# EAGLE design INTRO Robot Shield (EAGLE 6.4)
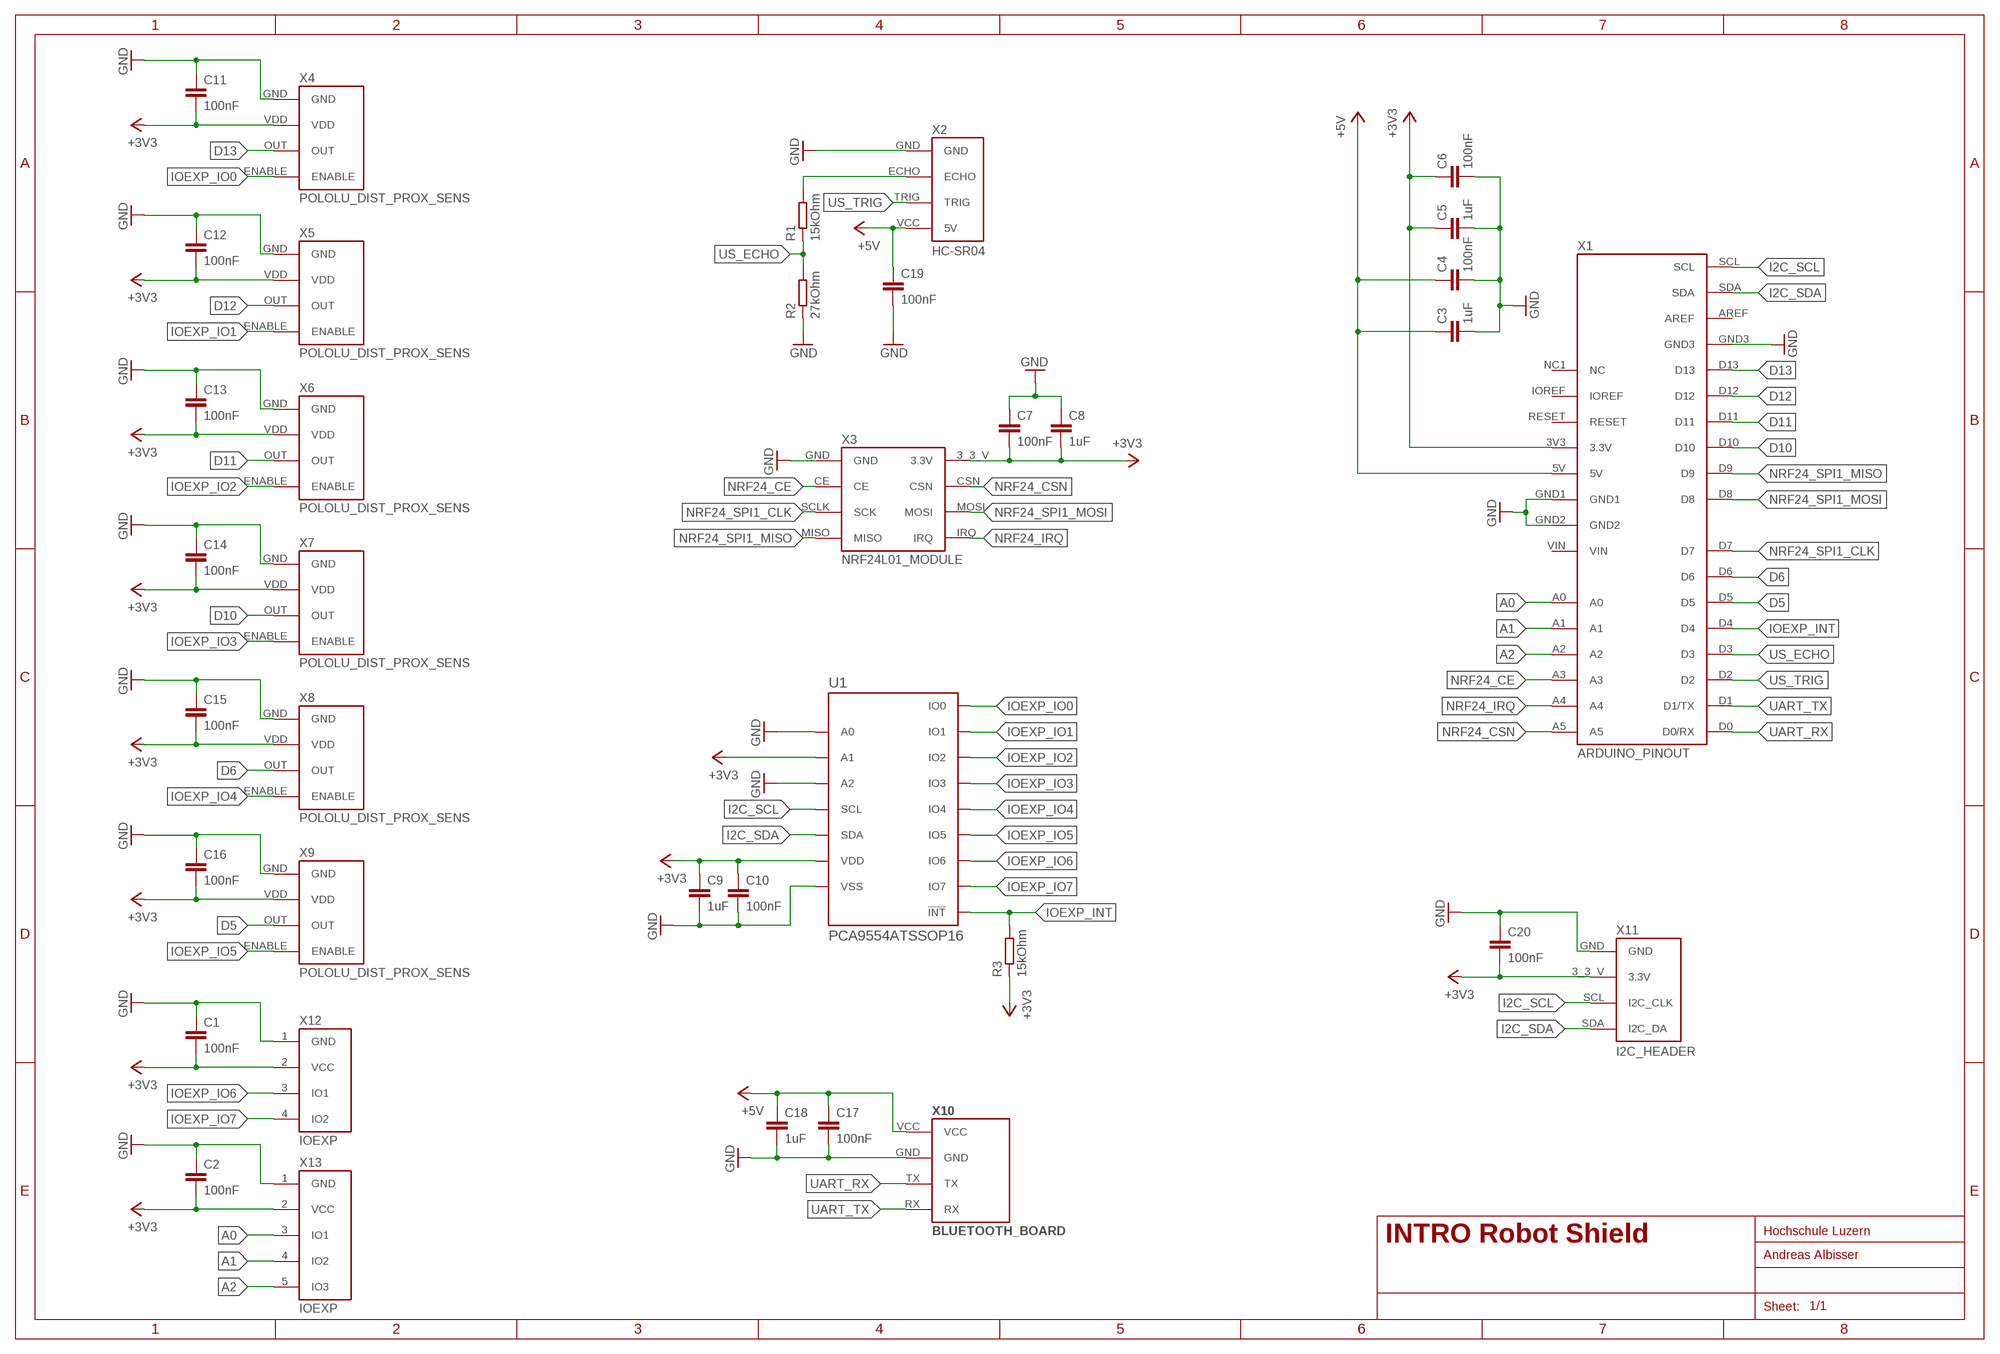
[diagram p0: schematic, sheet 1]

## Parts
C1  100nF  CAPACITOR0805  [0805]
C2  100nF  CAPACITOR0805  [0805]
C3  1uF  CAPACITOR0805  [0805]
C4  100nF  CAPACITOR0805  [0805]
C5  1uF  CAPACITOR0805  [0805]
C6  100nF  CAPACITOR0805  [0805]
C7  100nF  CAPACITOR0805  [0805]
C8  1uF  CAPACITOR0805  [0805]
C9  1uF  CAPACITOR0805  [0805]
C10  100nF  CAPACITOR0805  [0805]
C11  100nF  CAPACITOR0805  [0805]
C12  100nF  CAPACITOR0805  [0805]
C13  100nF  CAPACITOR0805  [0805]
C14  100nF  CAPACITOR0805  [0805]
C15  100nF  CAPACITOR0805  [0805]
C16  100nF  CAPACITOR0805  [0805]
C17  100nF  CAPACITOR0805  [0805]
C18  1uF  CAPACITOR0805  [0805]
C19  100nF  CAPACITOR0805  [0805]
C20  100nF  CAPACITOR0805  [0805]
R1  15kOhm  RESISTOR0805  [0805]
R2  27kOhm  RESISTOR0805  [0805]
R3  15kOhm  RESISTOR0805  [0805]
U1  PCA9554ATSSOP16  [TSSOP16]
X1  ARDUINO_PINOUT  ARDUINO_PINOUTINNER_LABEL  [ARDUINO_PINOUT_INNER_LABEL]
X2  HC-SR04  [HC-SR04_FOOTPRINT]
X3  NRF24L01_MODULE  [NRF24L01_MODULE_FOOTPRINT]
X4  POLOLU_DIST_PROX_SENS  [POLOLU_DIST_PROX_SENS_FOOTPRINT]
X5  POLOLU_DIST_PROX_SENS  [POLOLU_DIST_PROX_SENS_FOOTPRINT]
X6  POLOLU_DIST_PROX_SENS  [POLOLU_DIST_PROX_SENS_FOOTPRINT]
X7  POLOLU_DIST_PROX_SENS  [POLOLU_DIST_PROX_SENS_FOOTPRINT]
X8  POLOLU_DIST_PROX_SENS  [POLOLU_DIST_PROX_SENS_FOOTPRINT]
X9  POLOLU_DIST_PROX_SENS  [POLOLU_DIST_PROX_SENS_FOOTPRINT]
X10  BLUETOOTH_BOARD  [BT_BOARD_FOOTPRINT]
X11  I2C_HEADER  [I2C_HEADER_FOOTPRINT]
X12  IOEXP  IOEXP_2PTHT_2.54MM  [CONNECTORS_STIFTLEISTE_1X4_2.54]
X13  IOEXP  IOEXP_3PTHT_2.54MM  [CONNECTORS_STIFTLEISTE_1X5_2.54]

## Nets
+3V3: C1.2 C2.2 C5.1 C6.1 C7.2 C8.2 C9.1 C10.1 C11.2 C12.2 C13.2 C14.2 C15.2 C16.2 C20.2 R3.1 U1.2(A1) U1.16(VDD) X1.3V3(3.3V) X3.3_3_V(3.3V) X4.VDD X5.VDD X6.VDD X7.VDD X8.VDD X9.VDD X11.3_3_V(3.3V) X12.2(VCC) X13.2(VCC)
+5V: C3.1 C4.1 C17.1 C18.1 C19.1 X1.5V X2.VCC(5V) X10.VCC
A0: X1.A0 X13.3(IO1)
A1: X1.A1 X13.4(IO2)
A2: X1.A2 X13.5(IO3)
D5: X1.D5 X9.OUT
D6: X1.D6 X8.OUT
D10: X1.D10 X7.OUT
D11: X1.D11 X6.OUT
D12: X1.D12 X5.OUT
D13: X1.D13 X4.OUT
GND: C1.1 C2.1 C3.2 C4.2 C5.2 C6.2 C7.1 C8.1 C9.2 C10.2 C11.1 C12.1 C13.1 C14.1 C15.1 C16.1 C17.2 C18.2 C19.2 C20.1 R2.1 U1.1(A0) U1.3(A2) U1.8(VSS) X1.GND1 X1.GND2 X1.GND3 X2.GND X3.GND X4.GND X5.GND X6.GND X7.GND X8.GND X9.GND X10.GND X11.GND X12.1(GND) X13.1(GND)
I2C_SCL: U1.14(SCL) X1.SCL X11.SCL(I2C_CLK)
I2C_SDA: U1.15(SDA) X1.SDA X11.SDA(I2C_DA)
IOEXP_INT: R3.2 U1.13(!INT) X1.D4
IOEXP_IO0: U1.4(IO0) X4.ENABLE
IOEXP_IO1: U1.5(IO1) X5.ENABLE
IOEXP_IO2: U1.6(IO2) X6.ENABLE
IOEXP_IO3: U1.7(IO3) X7.ENABLE
IOEXP_IO4: U1.9(IO4) X8.ENABLE
IOEXP_IO5: U1.10(IO5) X9.ENABLE
IOEXP_IO6: U1.11(IO6) X12.3(IO1)
IOEXP_IO7: U1.12(IO7) X12.4(IO2)
N$1: R1.2 X2.ECHO
NRF24_CE: X1.A3 X3.CE
NRF24_CSN: X1.A5 X3.CSN
NRF24_IRQ: X1.A4 X3.IRQ
NRF24_SPI1_CLK: X1.D7 X3.SCLK(SCK)
NRF24_SPI1_MISO: X1.D9 X3.MISO
NRF24_SPI1_MOSI: X1.D8 X3.MOSI
UART_RX: X1.D0(D0/RX) X10.TX
UART_TX: X1.D1(D1/TX) X10.RX
US_ECHO: R1.1 R2.2 X1.D3
US_TRIG: X1.D2 X2.TRIG
Unconnected: X1.AREF X1.IOREF X1.NC1(NC) X1.RESET X1.VIN

## Library data of the parts
C1-C20 = INTRO_Robot:CAPACITOR
R1-R3 = INTRO_Robot:RESISTOR
U1 = INTRO_Robot:PCA9554A; DISTRIBUTOR: Mouser; DISTRIBUTOR_NR: 771-PCA9554PW-T
X1 = INTRO_Robot:ARDUINO_PINOUT
X2 = Ultrasonic Sensor HC-SR04:HC-SR04: Ultrasonic Sensor HC-SR04
X3 = Nordic Semiconductors 2.4GHz Transceiver:NRF24L01_MODULE: This module based on Nordic nRF24L01, highly integrated, ultra low power (ULP) 2Mbps RF transceiver for the 2.4GHz ISM (Industrial, Scientific and Medical) band. Nordic nRF24L01+ integrates a complete 2.4GHz RF transceiver, RF synthesizer, and baseband logic including the Enhanced ShockBurst™ hardware protocol accelerator supporting a high-speed SPI interface for the application controller.
X4-X9 = Pololu Digital Distance and Proximity Sensors:POLOLU_DIST_PROX_SENS: Pololu Digital Distance and Proximity Sensors; Pololu Items Nr. 1134; 1132; 2460; 2461
X10 = Bluetooth HC-05:BLUETOOTH_BOARD: Bluetooth Board V1.05
X11 = I2C_Header:I2C_HEADER
X12 = INTRO_Robot:IOEXP_2P
X13 = INTRO_Robot:IOEXP_3P

## Board
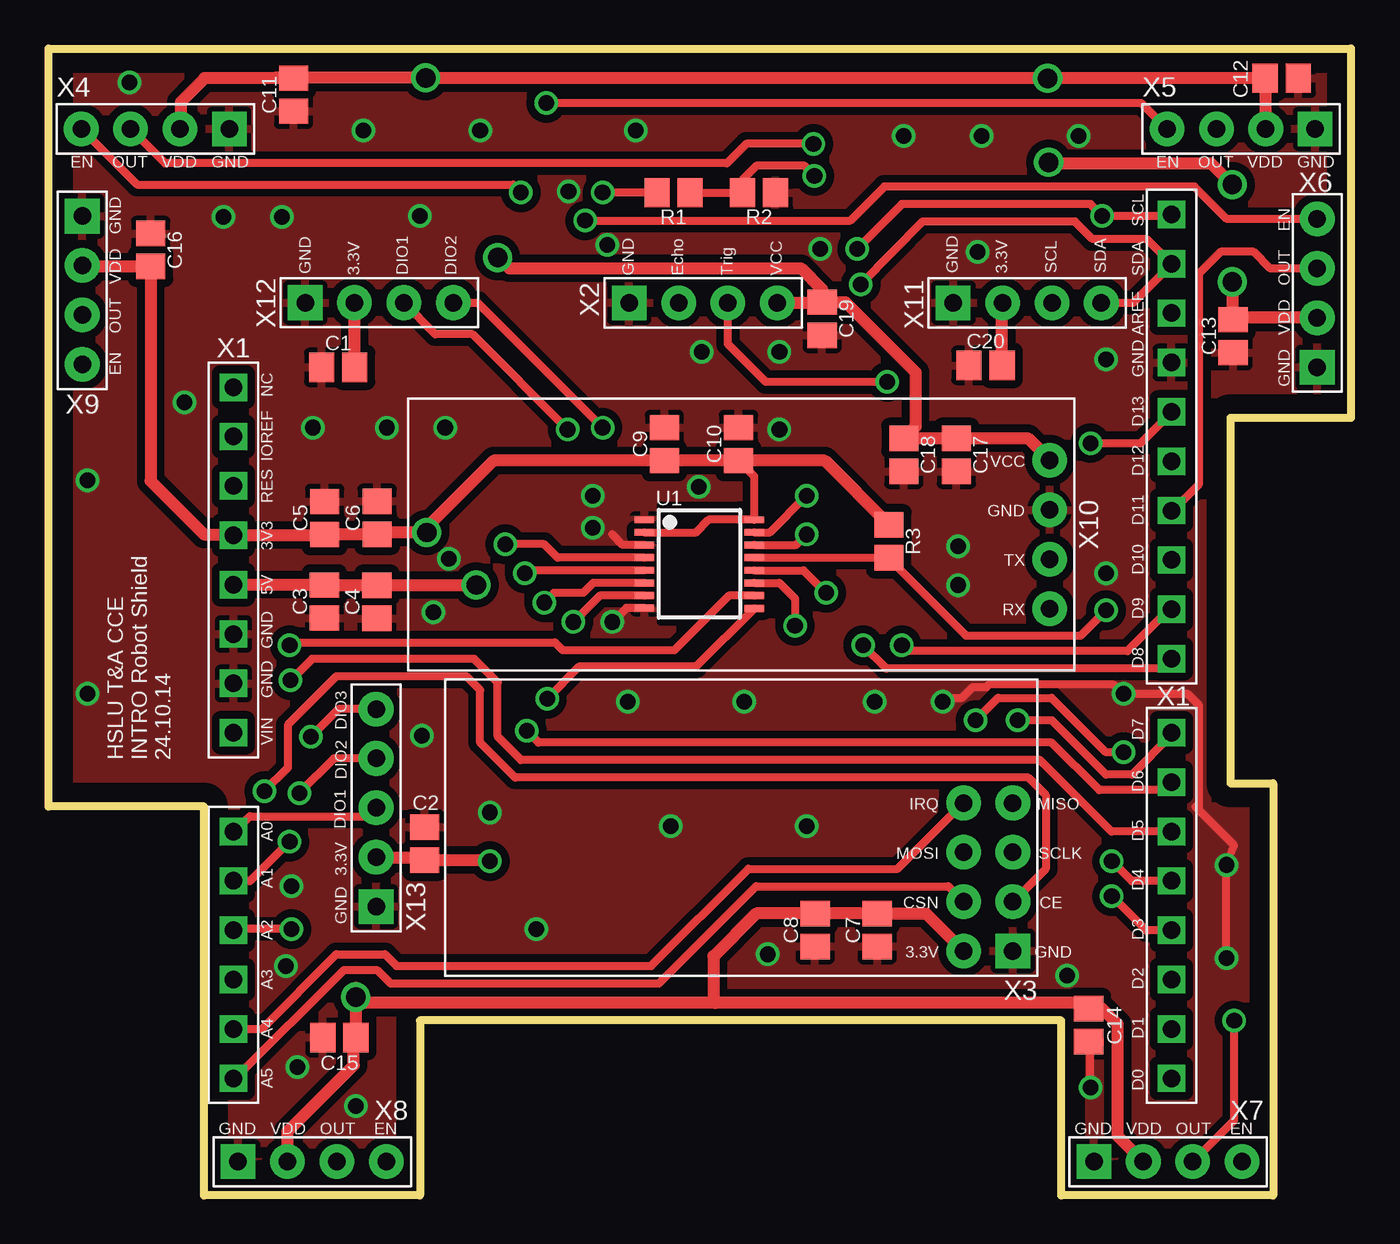
[diagram p1: board, top side]
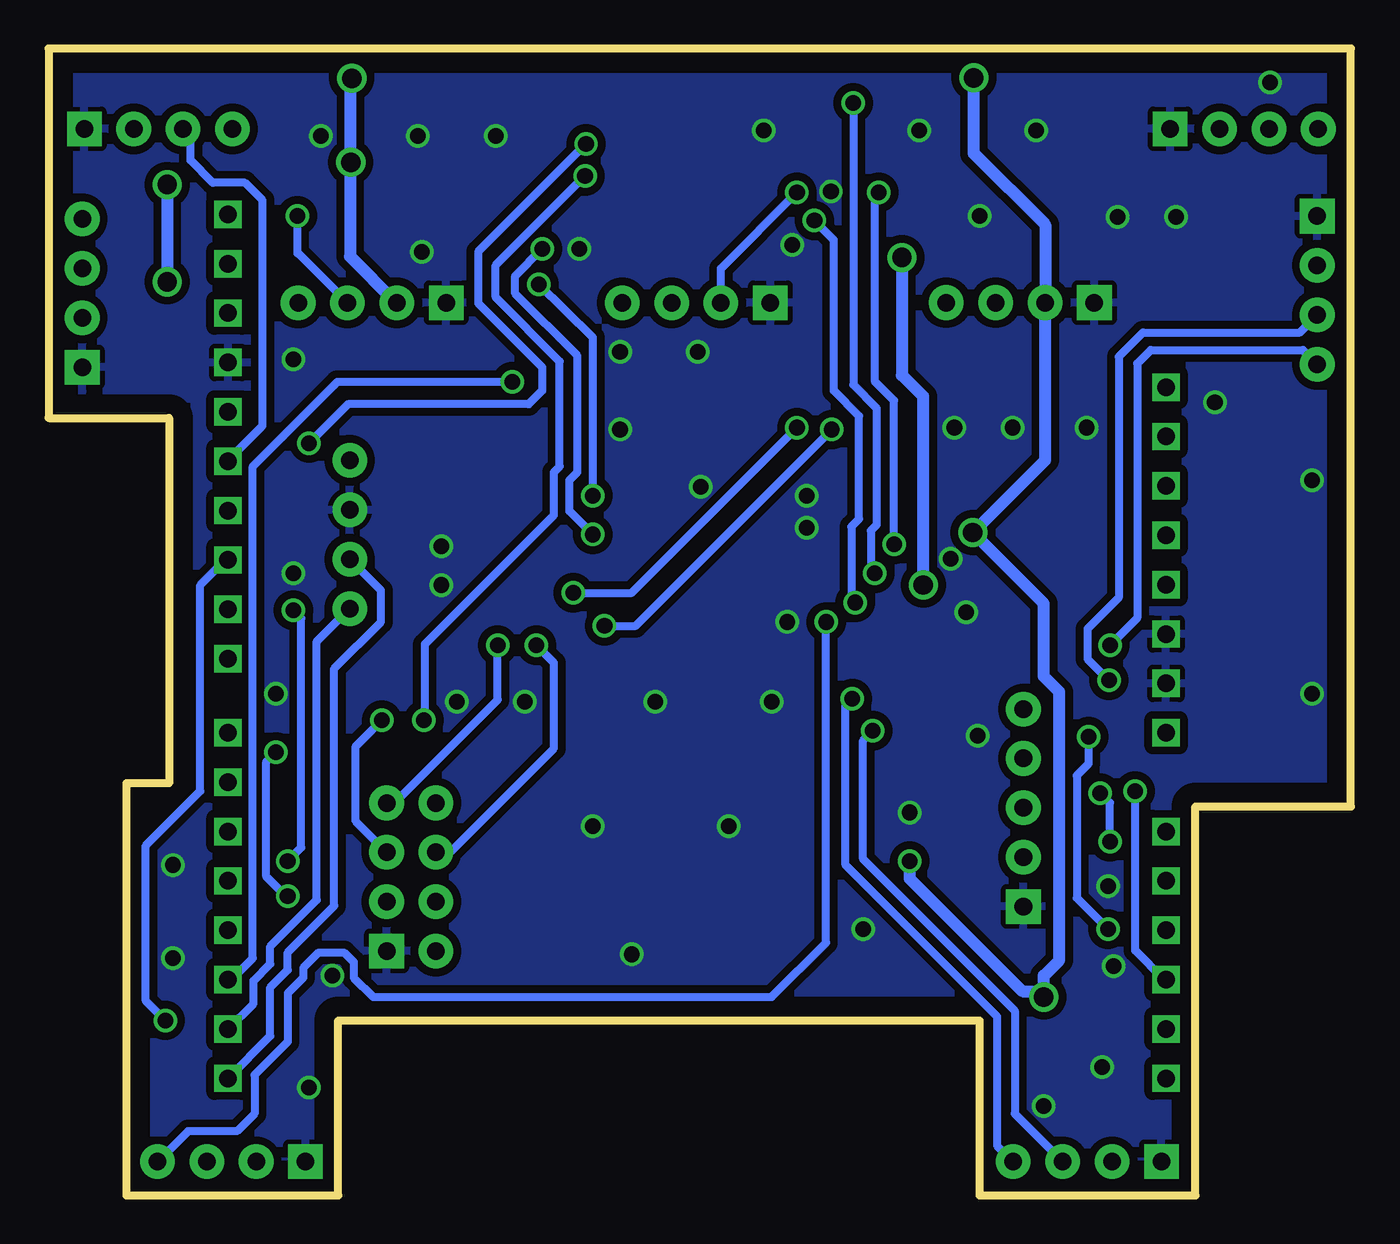
[diagram p2: board, bottom side, seen from below]

Size 67 x 59 mm. Coordinates in mm from the lower left corner, seen from the top.
Outline: 8,0 8,20 0,20 0,59 67,59 67,40 60.8,40 60.8,21.2 63,21.2 63,0 52.1,0 52.1,9 19.1,9 19.1,0 8,0
Copper layers (1*16): Top 0.035mm / dielectric 1.5mm / Bottom 0.035mm
Design rules "default": minimum track width 10mil, minimum drill 24mil, track to track 8mil, track to pad 8mil, pad to pad 8mil, via to via 8mil, smd to smd 8mil, copper to edge 40mil, drill to drill 8mil, minimum pad ring 10mil, minimum via ring 8mil, stop-mask expansion 4mil, vias tented up to drill 0mil, thermal gap 10mil

### Footprints (pad centres in the part's own frame; a part is rotated, then mirrored left to right if it is on the bottom)
0805 = smd 1.3 x 1.5: 1 -0.85,0; 2 0.85,0
TSSOP16 = smd 0.35 x 1: 1 -1.95,-2.825; 2 -1.3,-2.825; 3 -0.65,-2.825; 4 0,-2.825; 5 0.65,-2.825; 6 1.3,-2.825; 7 1.95,-2.825; 8 2.585,-2.825; 9 2.61,2.825; 10 1.95,2.825; 11 1.3,2.825; 12 0.65,2.825; 13 0,2.825; 14 -0.65,2.825; 15 -1.3,2.825; 16 -1.95,2.825
ARDUINO_PINOUT_INNER_LABEL = drill 0.9 square: 3V3 -24.13,12.7; 5V -24.13,10.16; A0 -24.13,-2.54; A1 -24.13,-5.08; A2 -24.13,-7.62; A3 -24.13,-10.16; A4 -24.13,-12.7; A5 -24.13,-15.24; AREF 24.13,24.13; D0 24.13,-15.24; D1 24.13,-12.7; D2 24.13,-10.16; D3 24.13,-7.62; D4 24.13,-5.08; D5 24.13,-2.54; D6 24.13,0; D7 24.13,2.54; D8 24.13,6.35; D9 24.13,8.89; D10 24.13,11.43; D11 24.13,13.97; D12 24.13,16.51; D13 24.13,19.05; GND1 -24.13,7.62; GND2 -24.13,5.08; GND3 24.13,21.59; IOREF -24.13,17.78; NC1 -24.13,20.32; RESET -24.13,15.24; SCL 24.13,29.21; SDA 24.13,26.67; VIN -24.13,2.54
HC-SR04_FOOTPRINT = drill 0.9 pad 1.778: ECHO 0,1.27; TRIG 0,-1.27; VCC 0,-3.81 | drill 0.9 pad 1.778 square: GND 0,3.81
NRF24L01_MODULE_FOOTPRINT = drill 0.9 pad 1.778: 3_3_V -11.43,6.35; CE -13.97,3.81; CSN -11.43,3.81; IRQ -11.43,-1.27; MISO -13.97,-1.27; MOSI -11.43,1.27; SCLK -13.97,1.27 | drill 0.9 pad 1.778 square: GND -13.97,6.35
POLOLU_DIST_PROX_SENS_FOOTPRINT = drill 0.9 pad 1.778: ENABLE 0,-3.81; OUT 0,-1.27; VDD 0,1.27 | drill 0.9 pad 1.778 square: GND 0,3.81
BT_BOARD_FOOTPRINT = drill 0.9 pad 1.778: GND -16.51,-1.27; RX -16.51,3.81; TX -16.51,1.27; VCC -16.51,-3.81
I2C_HEADER_FOOTPRINT = drill 0.9 pad 1.778: 3_3_V -1.27,0; SCL 1.27,0; SDA 3.81,0 | drill 0.9 pad 1.778 square: GND -3.81,0
CONNECTORS_STIFTLEISTE_1X4_2.54 = drill 0.9 pad 1.778 square: 1 -3.81,0 | drill 0.9 pad 1.778: 2 -1.27,0; 3 1.27,0; 4 3.81,0
CONNECTORS_STIFTLEISTE_1X5_2.54 = drill 0.9 pad 1.778 square: 1 -5.08,0 | drill 0.9 pad 1.778: 2 -2.54,0; 3 0,0; 4 2.54,0; 5 5.08,0

### Placement (x,y rotation side)
C1  14.9,42.6 0 top
C2  19.35,18.1 270 top
C3  14.19,30.55 270 top
C4  16.89,30.54 270 top
C5  14.2,34.85 90 top
C6  16.9,34.86 90 top
C7  42.63,13.65 90 top
C8  39.44,13.65 90 top
C9  31.68,38.65 90 top
C10  35.49,38.65 90 top
C11  12.6,56.63 90 top
C12  63.44,57.47 180 top
C13  60.94,44.21 90 top
C14  53.51,8.76 90 top
C15  14.96,8.12 0 top
C16  5.25,48.64 270 top
C17  46.7,38.1 270 top
C18  44,38.1 270 top
C19  39.8,45.1 270 top
C20  48.2,42.7 0 top
R1  32.15,51.58 180 top
R2  36.55,51.59 180 top
R3  43.23,33.65 270 top
U1  33.48,32.81 270 top
X1  33.64,21.26 0 top
X2  33.68,45.92 90 top
X3  35.64,18.92 180 top
X4  5.49,54.87 270 top
X5  61.35,54.87 270 top
X6  65.27,46.42 180 top
X7  57.59,1.73 90 top
X8  13.56,1.73 90 top
X9  1.73,46.57 0 top
X10  35,34 180 top
X11  50.35,45.92 0 top
X12  17.01,45.93 0 top
X13  16.85,19.94 90 top

### Tracks (layer width: path | path; a pad name or v marks a point on that pad's centre or on a via)
+3V3  (via drill 0.8, 1)
  Top 0.406: C10.1 36.3,36.98 U1.16 33.96,34.76 33.31,34.11 U1.2 | X1.3V3 9.49,33.96 9.49,34
  Top 0.61: 14.15,33.95 C5.1 | C5.1 C6.1 16.99,34.1 v19.45,34.1 19.45,34.35 22.9,37.8 C9.1 C10.1 39.93,37.8 R3.1 | 53.92,9.5 C14.2 | C14.2 53.79,9.61 53.5,9.9 34.3,9.9 | C14.2 54.2,9.6 55,8.8 55,3.05 X7.VDD | 34.3,9.9 16.1,9.9 v15.8,10.2 15.8,10.68 15.81,10.69 C15.2 15.7,8.01 15.7,6.7 12.29,3.29 X8.VDD | 34.3,9.9 34.2,10 34.2,12.3 36.4,14.5 C8.2 C7.2 45.14,14.5 X3.3_3_V | v51.45,53.15 51.5,53.1 59.8,53.1 v60.9,52 | 9.49,34 8,34 5.25,36.75 C16.2 1.78,47.79 X9.VDD | 15.75,43.02 C1.2 | X4.VDD 6.8,54.91 6.8,56.25 8.03,57.48 C11.2 11.62,57.5 v19.4,57.5 19.43,57.47 v51.4,57.47 C12.2 62.59,54.9 X5.VDD | v60.9,47 60.9,45.1 C13.2 61.03,45.15 X6.VDD | 15.75,43.02 15.73,43 | 15.75,43.02 X12.2 | X13.2 19.2,17.4 C2.2 22.65,17.25 v22.7,17.2 | C20.2 49.05,45.89 X11.3_3_V | X1.3V3 14.2,33.96 C5.1
  Bottom 0.61: v19.4,57.5 19.4,53.6 15.73,49.93 X12.2 15.73,37.82 v19.45,34.1 15.8,30.45 15.8,26.7 15,25.9 15,12.1 15.8,11.3 v15.8,10.2 16.1,10.5 16.9,10.5 22.7,16.3 v22.7,17.2 | v51.4,57.47 51.45,57.02 v51.45,53.15 51.5,53.1 51.5,48.31 49.11,45.92 X11.3_3_V | v60.9,52 v60.9,47
+5V  (via drill 1)
  Top 0.61: C3.1 | C3.1 C4.1 v21.99,31.39 v22,31.4 | C19.1 39.8,46.6 38.7,47.7 23.7,47.7 23.55,47.85 23.5,47.85 v23.1,48.25 | X2.VCC 39.77,45.92 C19.1 | C19.1 41,45.95 44.6,42.35 44.6,39.55 C18.1 C17.1 50.37,38.95 X10.VCC | X1.5V 14.19,31.42 C3.1
  Bottom 0.61: v22,31.4 22,41.1 23.1,42.2 v23.1,48.25
A0
  Top 0.406: X13.3 16.41,19.5 10.35,19.5 9.56,18.71 X1.A0
A1  (via drill 0.8)
  Top 0.406: v12.4,18.2 10.37,16.17 X1.A1 | X13.4 14.68,22.48 v12.9,20.7
  Bottom 0.406: v12.4,18.2 12.4,20.2 v12.9,20.7
A2  (via drill 0.8)
  Top 0.406: v12.5,13.7 9.61,13.7 9.61,13.64 X1.A2 | X13.5 14.92,25.02 v13.5,23.6
  Bottom 0.406: v13.5,23.6 13.5,22.2 14.1,21.6 14.1,15.3 v12.5,13.7
D5  (via drill 0.8)
  Top 0.406: v12.45,26.5 13.55,27.6 21.9,27.6 23.1,26.4 23.1,23.6 24.3,22.4 51,22.4 54.69,18.71 54.7,18.72 X1.D5
  Bottom 0.406: v12.45,26.5 13.55,27.6 13.55,29.15 11.95,30.75 11.95,43.15 10.7,44.4 2.63,44.4 X9.OUT
D6  (via drill 0.8)
  Top 0.406: v24.6,23.9 25.2,23.3 51.6,23.3 54.05,20.85 57.4,20.85 57.77,21.22 X1.D6
  Bottom 0.406: v24.6,23.9 25.1,23.4 25.1,17.3 17.3,9.5 17.3,4.2 X8.OUT
D10  (via drill 0.8)
  Top 0.406: v61,9 61,3.87 X7.OUT
  Bottom 0.406: v61,9 62,10 62,18 59.2,20.8 59.2,31.4 57.91,32.69 X1.D10
D11
  Top 0.406: X6.OUT 62.86,47.69 62,48.55 60.3,48.55 59.2,47.45 59.2,36.6 57.82,35.22 X1.D11
D12
  Bottom 0.406: X5.OUT 59.7,54.49 59.7,53.25 58.55,52.1 56.9,52.1 56,51.2 56,39.6 57.74,37.86 57.74,37.76 X1.D12
D13  (via drill 0.8)
  Top 0.406: v53.6,38.7 56.2,38.7 57.77,40.27 X1.D13 | X4.OUT 5.99,53.1 34.9,53.1 35.9,54.1 v39.35,54.1
  Bottom 0.406: v53.6,38.7 51.6,40.7 42.3,40.7 41.6,41.4 41.6,42.6 44.9,45.9 44.9,48.55 v39.35,54.1
GND  (via drill 0.8)
  Top 0.406: U1.3 29.54,33.46 29,34 | U1.8 29.73,30.23 v29,29.5 | v60.6,12.2 v60.6,17 61,18 59,20 59.2,20 59.2,25.2 58.6,25.8 v55.3,25.8 | 53.78,7.64 C14.1 53.6,7.82 v53.6,5.55 | 46,25.6 47,25.6 47.55,26.15 48.25,26.15 48.4,26.3 54.75,26.3 55.3,25.75
  other vias: 32,19 37,12.4 25.1,13.7 44,54.5 48,54.5 19.8,30 28,36 35.8,25.4 13.6,39.5 17.4,39.5 22.2,54.8 22.7,19.7 12.8,6.6 12.2,11.8 39.7,48.7 26.75,51.65 39,19 42.5,25.4 46.8,33.4 46.8,31.4 29.8,25.4 12.5,15.9 52.4,11.3 37.6,43.4 37.6,39.4 53,54.5 54.4,43 15.8,4.6 20.6,32.75 30.2,54.8 19.1,50.4 12,50.35 7,40.8 2,36.8 2,25.8 9,50.35 16.2,54.8 20.4,39.5 28,34.35 19.2,23.65 54.4,32 47.8,48.55 33.6,43.4 33.45,36.45 4.15,57.25 28.75,48.9 46,25.4
  pour Top (isolate 0.406): 1,58 66,58 66,41 59.6,41.05 59.6,20.05 62,20 62,2 53,2 53,10 18,10 18,2 9,2 9,21 1,21
  pour Bottom (isolate 0.406): 18,2 9,2 9,21 1,21 1,58 66,58 66,41 59.5,41 59.5,20 62,20 62,2 53,2 53,10 18,10
I2C_SCL  (via drill 0.8)
  Top 0.406: U1.14 38.46,33.46 v39,34 | v41.6,48.7 43.9,51 53.6,51 v54.2,50.4 57.74,50.4 57.74,50.47 X1.SCL
  Bottom 0.406: v39,34 40.2,35.2 40.2,36.8 39.8,37.2 39.8,43.2 43,46.4 43,47.3 v41.6,48.7 | v54.2,50.4 54.2,48.47 54.17,48.47 X11.SCL
I2C_SDA  (via drill 0.8)
  Top 0.406: U1.15 37.11,34.11 v39,36 | X1.SDA | X1.SDA 56.5,49.2 53.7,49.2 52.8,50.1 44.96,50.1 v41.78,46.87 41.72,46.82 | X11.SDA 55.8,45.92 57.77,47.89 X1.SDA
  Bottom 0.406: v39,36 39,44.14 v41.78,46.87
IOEXP_INT  (via drill 0.8)
  Top 0.406: U1.13 R3.2 43.23,32.77 47.2,28.8 53.1,28.8 v54.4,30.1 | v54.7,17.2 55.73,16.17 55.74,16.18 X1.D4
  Bottom 0.406: v54.7,17.2 54,17.9 54,29.7 v54.4,30.1
IOEXP_IO0  (via drill 0.8)
  Top 0.406: U1.4 26.19,32.81 25.5,33.5 v23.5,33.5 | v24.3,51.6 23.9,52 4.55,52 X4.ENABLE
  Bottom 0.406: v23.5,33.5 23.5,40.9 24.5,41.9 24.5,51.4 v24.3,51.6
IOEXP_IO1  (via drill 0.8)
  Top 0.406: U1.5 24.66,32.16 v24.5,32 | v25.6,56.2 56.21,56.2 X5.ENABLE
  Bottom 0.406: v24.5,32 24.7,32.2 24.7,34.2 24.4,34.5 24.4,40.5 25.6,41.7 v25.6,56.2
IOEXP_IO2  (via drill 0.8)
  Top 0.406: U1.6 28.01,31.51 27.5,31 26,31 v25.5,30.5 | X6.ENABLE 60.62,50.23 58.95,51.9 43,51.9 41.25,50.15 v27.6,50.15
  Bottom 0.406: v25.5,30.5 25.7,30.7 25.7,34.4 25.3,34.8 25.3,40.1 26.6,41.4 26.6,49.15 v27.6,50.15
IOEXP_IO3  (via drill 0.8)
  Top 0.406: U1.7 28.36,30.86 v27,29.5
  Bottom 0.406: v27,29.5 27,13 29.8,10.2 50.3,10.2 51.3,11.2 51.3,12 51.8,12.5 53.1,12.5 53.9,11.7 53.9,11.2 54.7,10.4 54.7,7.9 56.4,6.2 56.4,4.2 57.3,3.3 59.83,3.3 X7.ENABLE
IOEXP_IO4  (via drill 0.8)
  Top 0.406: U1.9 33.3,27.2 27.3,27.2 v25.65,25.55
  Bottom 0.406: X8.ENABLE 18.2,2.56 18.2,9.2 26,17 26,25.2 v25.65,25.55
IOEXP_IO5  (via drill 0.8)
  Top 0.406: U1.10 35,30.86 32.19,28.05 26.45,28.05 26.05,28.45 12.55,28.45 v12.4,28.3
  Bottom 0.406: v12.4,28.3 11,29.7 11,42.8 10.3,43.5 2.47,43.5 X9.ENABLE
IOEXP_IO6  (via drill 0.8)
  Top 0.406: U1.11 37.59,31.51 38.4,30.7 v38.4,29.3 | v26.7,39.4 21.8,44.3 19.89,44.3 19.89,44.32 X12.3
  Bottom 0.406: v38.4,29.3 36.8,29.3 v26.7,39.4
IOEXP_IO7  (via drill 0.8)
  Top 0.406: U1.12 38.84,32.16 v40,31 | v28.5,39.5 22.07,45.93 X12.4
  Bottom 0.406: v40,31 37,31 v28.5,39.5
N$1  (via drill 0.8)
  Top 0.406: v28.5,51.6 31.28,51.6 R1.2
  Bottom 0.406: v28.5,51.6 32.41,47.69 X2.ECHO
N$2
  cutout Top: 31.5,35.5 35.5,35.5 35.5,29.5 31.5,29.5
NRF24_CE  (via drill 0.8)
  Top 0.406: v11.1,20.8 12.3,22 12.3,24.2 14.8,26.7 21.5,26.7 22.2,26 22.2,23.3 24,21.5 50.4,21.5 51.3,20.6 51.3,16.8 X3.CE
  Bottom 0.406: v11.1,20.8 11.1,12.6 9.59,11.09 X1.A3
NRF24_CSN
  Top 0.406: X3.CSN 46.28,15.9 36.4,15.9 31.4,10.9 17.6,10.9 16.9,11.6 15.2,11.6 9.61,6.01 X1.A5
NRF24_IRQ
  Top 0.406: X3.IRQ 43.68,16.8 36,16.8 31,11.8 17.9,11.8 17.3,12.4 14.8,12.4 10.95,8.55 10.95,8.56 X1.A4
NRF24_SPI1_CLK  (via drill 0.8)
  Top 0.406: v49.85,24.45 51.6,24.45 54.4,21.65 55.75,21.65 57.8,23.7 57.8,23.77 X1.D7
  Bottom 0.406: X3.SCLK 51.2,19.24 51.2,23.1 v49.85,24.45
NRF24_SPI1_MISO  (via drill 0.8)
  Top 0.406: v43.9,28.3 44.2,28 55.5,28 57.64,30.14 X1.D9
  Bottom 0.406: v43.9,28.3 43.9,25.5 49.21,20.19 X3.MISO
NRF24_SPI1_MOSI  (via drill 0.8)
  Top 0.406: v41.9,28.3 43.1,27.1 57.3,27.1 57.77,27.57 X1.D8
  Bottom 0.406: X3.MOSI 46.35,17.65 41,23 41,27.4 v41.9,28.3
UART_RX
  Bottom 0.406: X1.D0 55.6,8.2 55.6,10.7 54.7,11.6 54.7,12.5 52.3,14.9 52.3,27.1 49.9,29.5 49.9,31.12 X10.TX
UART_TX
  Bottom 0.406: X1.D1 56.46,9.86 56.46,11.04 55.6,11.9 55.6,12.8 53.2,15.2 53.2,28.5 X10.RX
US_ECHO  (via drill 0.8)
  Top 0.406: R1.1 R2.2 35.7,52.25 36.45,53 38.85,53 v39.4,52.45 | v54.7,15.4 56.47,13.63 56.48,13.64 X1.D3 | v55.3,22.8 54.4,22.8 51.6,25.6 48.85,25.6 v47.7,24.45
  Bottom 0.406: v54.7,15.4 54.8,15.4 55.8,16.4 55.8,22.3 v55.3,22.8 | v39.4,52.45 44,47.85 44,46.2 40.7,42.9 40.7,37.5 41,37.2 41,35 47.65,28.35 47.65,24.5 v47.7,24.45
US_TRIG  (via drill 0.8)
  Top 0.406: v43.15,41.85 36.9,41.85 34.95,43.8 X2.TRIG
  Bottom 0.406: v43.15,41.85 52.15,41.85 56.5,37.5 56.5,12.2 57.5,11.2 57.8,11.2 57.8,11.13 X1.D2

### Text on the board
tPlace: GND | 3.3V | DIO1 | DIO2 | DIO3 | HSLU T&A CCE / INTRO Robot Shield / 24.10.14 | DIO2 | DIO1 | 3.3V | GND